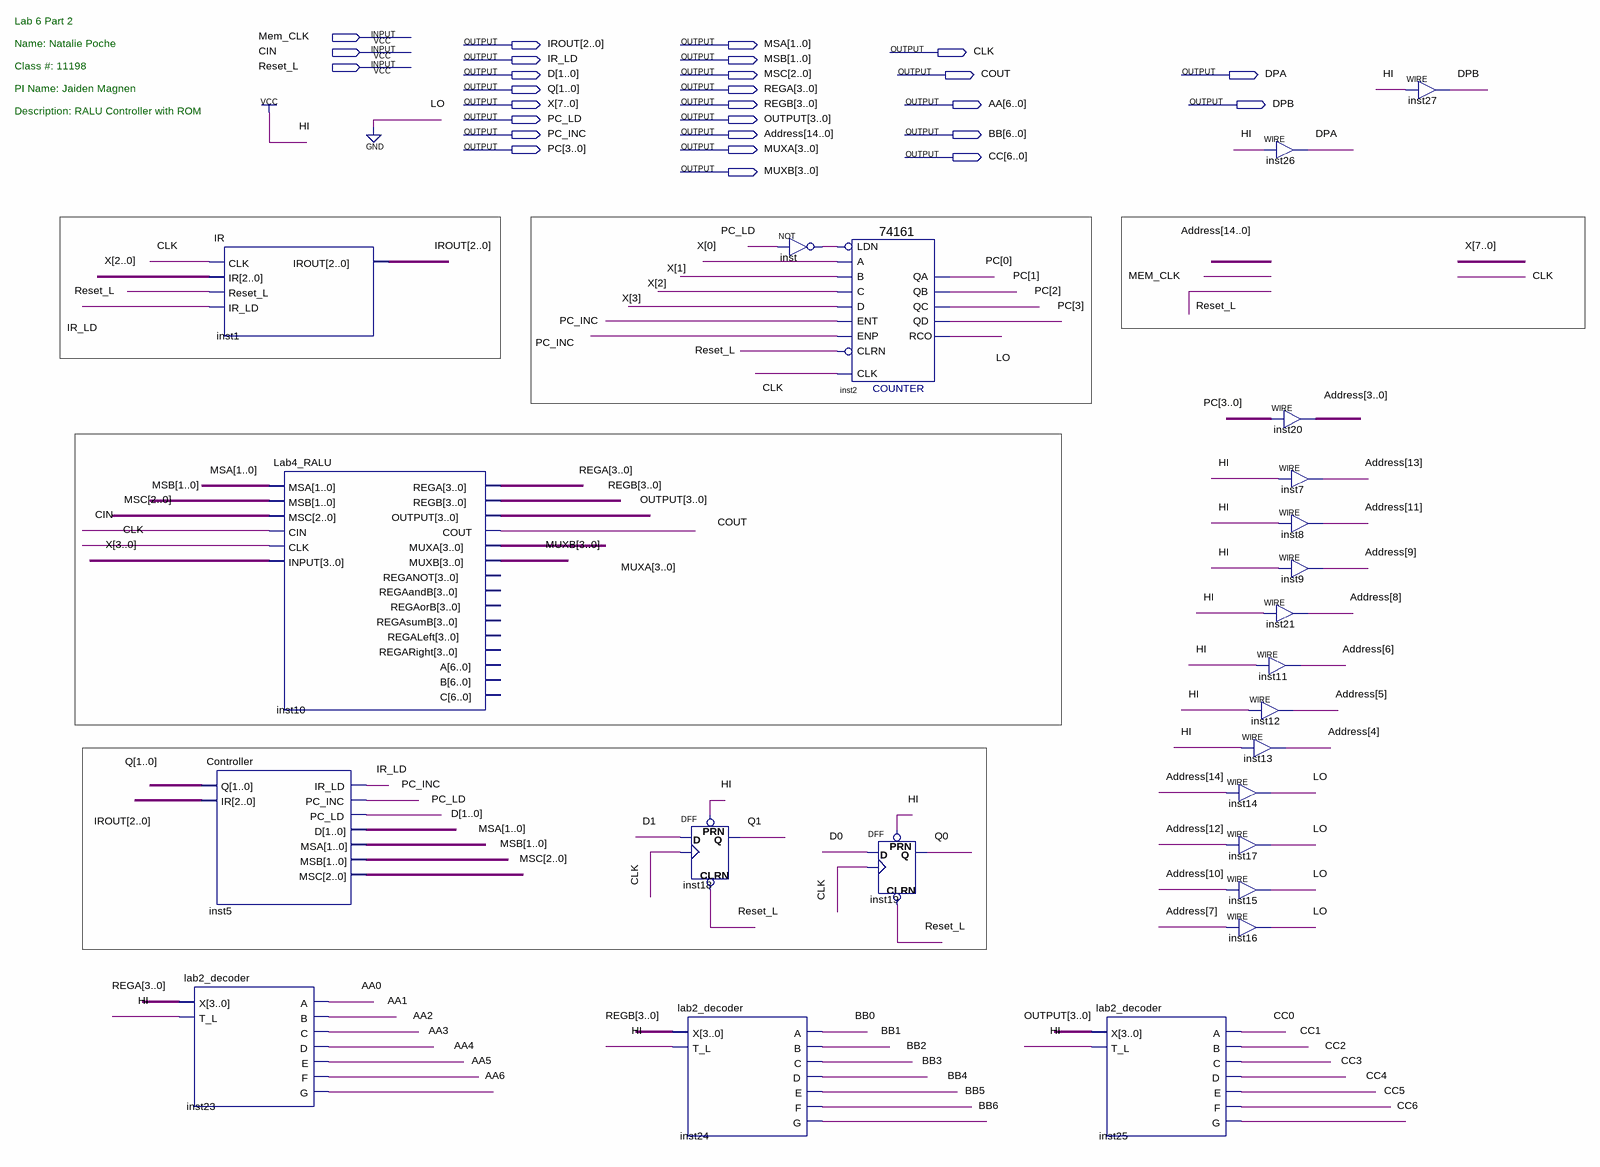
[diagram p0: schematic sheet]
// Quartus schematic LAB6_Part2.bdf as structural Verilog: 24 symbols, 27 pins
module LAB6_Part2 (
  input  Mem_CLK,
  input  CIN,
  input  Reset_L,
  output [2:0] IROUT,
  output [1:0] MSA,
  output CLK,
  output IR_LD,
  output [1:0] MSB,
  output [1:0] D,
  output [2:0] MSC,
  output COUT,
  output DPA,
  output [1:0] Q,
  output [3:0] REGA,
  output [7:0] X,
  output [3:0] REGB,
  output [6:0] AA,
  output DPB,
  output PC_LD,
  output [3:0] OUTPUT,
  output PC_INC,
  output [14:0] Address,
  output [6:0] BB,
  output [3:0] PC,
  output [3:0] MUXA,
  output [6:0] CC,
  output [3:0] MUXB
);

  wire inst_out, LO;

  IR inst1 (.CLK(CLK), .IR(X[2:0]), .Reset_L(Reset_L), .IR_LD(IR_LD), .IROUT(IROUT));
  Controller inst5 (
    .Q(Q), .IR(IROUT), .IR_LD(IR_LD), .PC_INC(PC_INC), .PC_LD(PC_LD), .D(D), .MSA(MSA), .MSB(MSB), .MSC(MSC));
  lab2_decoder inst23 (
    .X(REGA), .T_L(1'b1), .A(AA[0]), .B(AA[1]), .C(AA[2]), .D(AA[3]), .E(AA[4]), .F(AA[5]), .G(AA[6]));
  Lab4_RALU inst10 (
    .MSA(MSA), .MSB(MSB), .MSC(MSC), .CIN(CIN), .CLK(CLK), .INPUT(X[3:0]), .REGA(REGA), .REGB(REGB),
    .OUTPUT(OUTPUT), .COUT(COUT), .MUXA(MUXA), .MUXB(MUXB));  // open: REGANOT, REGAandB, REGAorB, REGAsumB, REGALeft, REGARight, A, B, C
  DFF inst18 (.CLRN(Reset_L), .CLK(CLK), .D(D[1]), .PRN(1'b1), .Q(Q[1]));
  lab2_decoder inst24 (
    .X(REGB), .T_L(1'b1), .A(BB[0]), .B(BB[1]), .C(BB[2]), .D(BB[3]), .E(BB[4]), .F(BB[5]), .G(BB[6]));
  not inst (inst_out, PC_LD);
  \74161  inst2 (
    .CLRN(Reset_L), .CLK(CLK), .ENP(PC_INC), .LDN(inst_out), .A(X[0]), .D(X[3]), .ENT(PC_INC), .B(X[1]),
    .C(X[2]), .QD(PC[3]), .QC(PC[2]), .QB(PC[1]), .QA(PC[0]), .RCO(LO));
  DFF inst19 (.CLRN(Reset_L), .CLK(CLK), .D(D[0]), .PRN(1'b1), .Q(Q[0]));
  lab2_decoder inst25 (
    .X(OUTPUT), .T_L(1'b1), .A(CC[0]), .B(CC[1]), .C(CC[2]), .D(CC[3]), .E(CC[4]), .F(CC[5]), .G(CC[6]));
  assign Address[4] = 1'b1;  // WIRE inst13
  assign LO = Address[14];  // WIRE inst14
  assign LO = Address[12];  // WIRE inst17
  assign LO = Address[10];  // WIRE inst15
  assign LO = Address[7];  // WIRE inst16
  assign DPA = 1'b1;  // WIRE inst26
  assign Address[3:0] = PC;  // WIRE inst20
  assign Address[13] = 1'b1;  // WIRE inst7
  assign Address[11] = 1'b1;  // WIRE inst8
  assign Address[9] = 1'b1;  // WIRE inst9
  assign Address[8] = 1'b1;  // WIRE inst21
  assign Address[6] = 1'b1;  // WIRE inst11
  assign Address[5] = 1'b1;  // WIRE inst12
  assign DPB = 1'b1;  // WIRE inst27
  // also tied to GND on the sheet: LO

  // Notes on the sheet:
  //   Lab 6 Part 2
  //   Name: Natalie Poche
  //   Class #: 11198
  //   PI Name: Jaiden Magnen
  //   Description: RALU Controller with ROM
endmodule
